# EAGLE design LifterV01 (EAGLE 9.5.1)

## Sheet 1 of 2: Analog Circuit
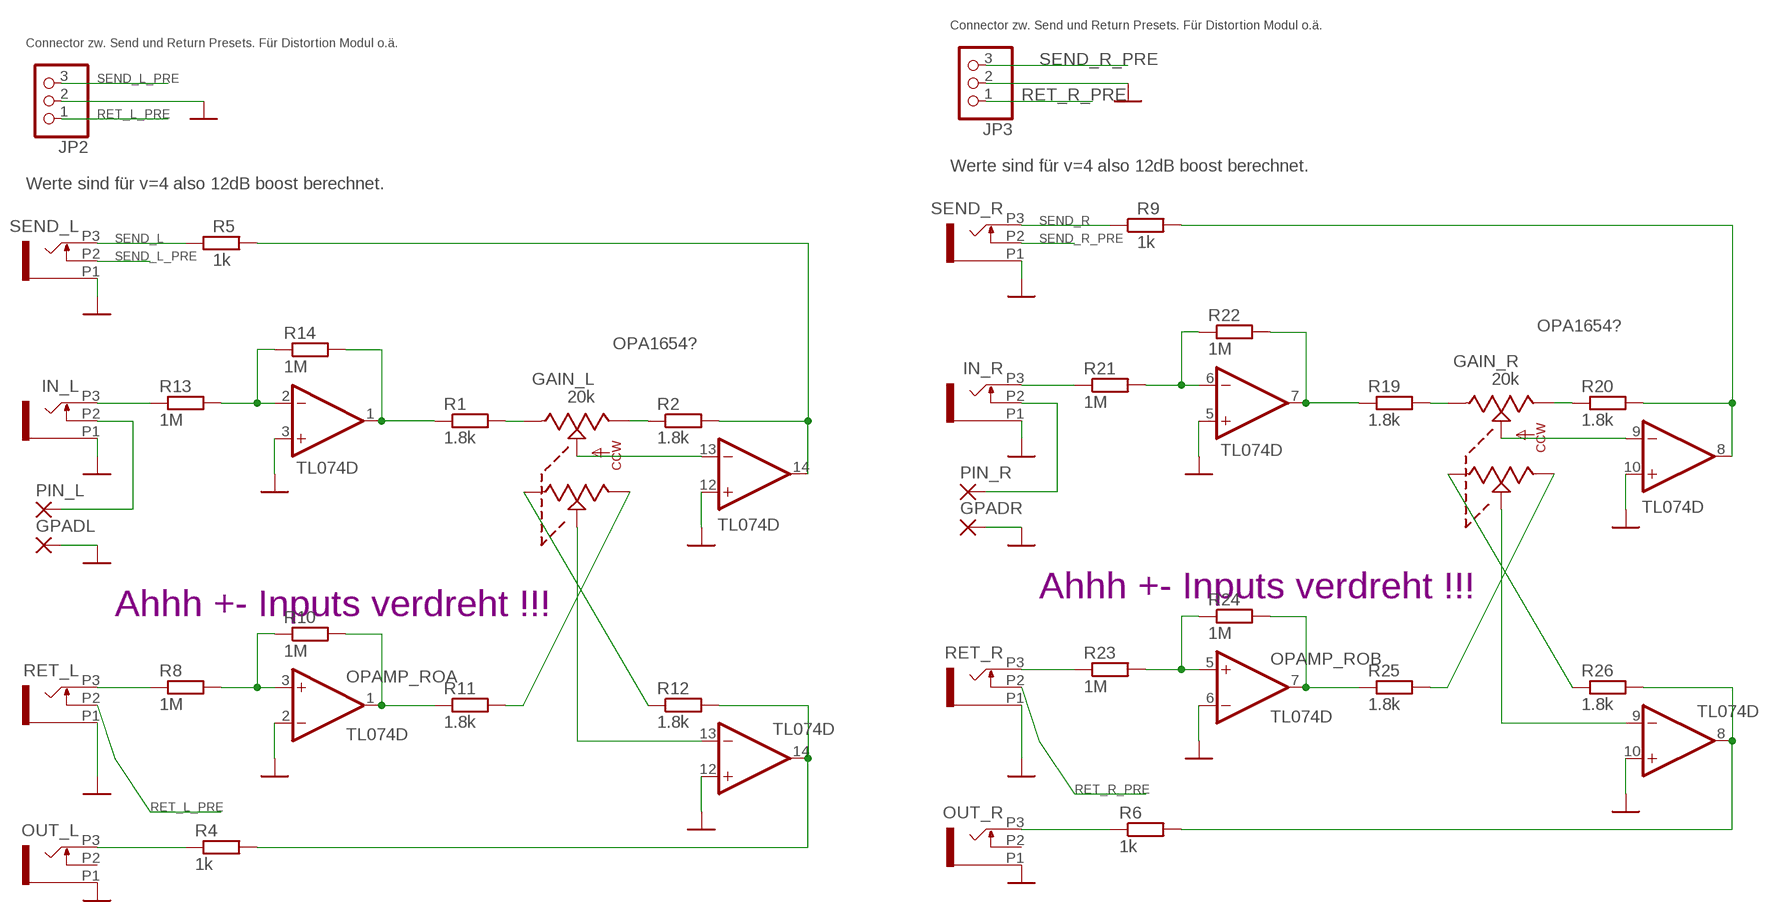
[diagram p0: schematic, sheet 1]

### Parts
GAIN_L  20k  POT_US_2X  [TT_2TAP_VERTICAL]
GAIN_R  20k  POT_US_2X  [TT_2TAP_VERTICAL]
GPADL  3,17/1,3  [3,17/1,3]
GPADR  3,17/1,3  [3,17/1,3]
IN_L  PJ301_THONKICONN6  [WQP_PJ_301M6]
IN_R  PJ301_THONKICONN6  [WQP_PJ_301M6]
JP2  PINHD-1X3  [1X03]
JP3  PINHD-1X3  [1X03]
OPAMP_IS  TL074D  [SO14]
OPAMP_RO  TL074D  [SO14]
OUT_L  PJ301_THONKICONN6  [WQP_PJ_301M6]
OUT_R  PJ301_THONKICONN6  [WQP_PJ_301M6]
PIN_L  3,17/1,3  [3,17/1,3]
PIN_R  3,17/1,3  [3,17/1,3]
R1  1.8k  R-EU_R0603  [R0603]
R2  1.8k  R-EU_R0603  [R0603]
R4  1k  R-EU_R0603  [R0603]
R5  1k  R-EU_R0603  [R0603]
R6  1k  R-EU_R0603  [R0603]
R8  1M  R-EU_R0603  [R0603]
R9  1k  R-EU_R0603  [R0603]
R10  1M  R-EU_R0603  [R0603]
R11  1.8k  R-EU_R0603  [R0603]
R12  1.8k  R-EU_R0603  [R0603]
R13  1M  R-EU_R0603  [R0603]
R14  1M  R-EU_R0603  [R0603]
R19  1.8k  R-EU_R0603  [R0603]
R20  1.8k  R-EU_R0603  [R0603]
R21  1M  R-EU_R0603  [R0603]
R22  1M  R-EU_R0603  [R0603]
R23  1M  R-EU_R0603  [R0603]
R24  1M  R-EU_R0603  [R0603]
R25  1.8k  R-EU_R0603  [R0603]
R26  1.8k  R-EU_R0603  [R0603]
RET_L  PJ301_THONKICONN6  [WQP_PJ_301M6]
RET_R  PJ301_THONKICONN6  [WQP_PJ_301M6]
SEND_L  PJ301_THONKICONN6  [WQP_PJ_301M6]
SEND_R  PJ301_THONKICONN6  [WQP_PJ_301M6]

### Nets
GND: GPADL.1(P) GPADR.1(P) IN_L.P1 IN_R.P1 JP2.2 JP3.2 OPAMP_IS.3(A:+IN) OPAMP_IS.5(B:+IN) OPAMP_IS.10(C:+IN) OPAMP_IS.12(D:+IN) OPAMP_RO.2(A:-IN) OPAMP_RO.6(B:-IN) OPAMP_RO.10(C:+IN) OPAMP_RO.12(D:+IN) OUT_L.P1 OUT_R.P1 RET_L.P1 RET_R.P1 SEND_L.P1 SEND_R.P1 ; also sheet 2
N$1: GAIN_L.CCW R2.1
N$2: GAIN_L.CW R1.2
N$3: OPAMP_IS.14(D:OUT) R2.2 R5.2
N$4: GAIN_L.CENTER OPAMP_IS.13(D:-IN)
N$5: IN_L.P3 R13.1
N$6: OPAMP_IS.2(A:-IN) R13.2 R14.1
N$8: OPAMP_IS.1(A:OUT) R1.1 R14.2
N$9: OUT_L.P3 R4.1
N$10: R8.1 RET_L.P3
N$11: IN_L.P2 PIN_L.1(P)
N$17: OPAMP_RO.3(A:+IN) R8.2 R10.1
N$18: GAIN_L.CW1 R12.1
N$20: OPAMP_IS.8(C:OUT) R9.2 R20.2
N$21: OPAMP_RO.1(A:OUT) R10.2 R11.1
N$22: GAIN_L.CCW1 R11.2
N$23: GAIN_L.CENTER1 OPAMP_RO.13(D:-IN)
N$24: OPAMP_RO.14(D:OUT) R4.2 R12.2
N$26: IN_R.P2 PIN_R.1(P)
N$27: GAIN_R.CW R19.2
N$28: GAIN_R.CENTER OPAMP_IS.9(C:-IN)
N$29: GAIN_R.CCW R20.1
N$30: IN_R.P3 R21.1
N$31: OPAMP_IS.6(B:-IN) R21.2 R22.1
N$32: OPAMP_IS.7(B:OUT) R19.1 R22.2
N$33: R23.1 RET_R.P3
N$34: OPAMP_RO.5(B:+IN) R23.2 R24.1
N$35: OPAMP_RO.7(B:OUT) R24.2 R25.1
N$36: GAIN_R.CCW1 R25.2
N$37: GAIN_R.CW1 R26.1
N$38: GAIN_R.CENTER1 OPAMP_RO.9(C:-IN)
N$39: OPAMP_RO.8(C:OUT) R6.2 R26.2
N$40: OUT_R.P3 R6.1
RET_L_PRE: JP2.1 RET_L.P2
RET_R_PRE: JP3.1 RET_R.P2
SEND_L: R5.1 SEND_L.P3 ; also sheet 2
SEND_L_PRE: JP2.3 SEND_L.P2
SEND_R: R9.1 SEND_R.P3 ; also sheet 2
SEND_R_PRE: JP3.3 SEND_R.P2
Unconnected: OUT_L.P2 OUT_R.P2

### Notes on the sheet
- Connector zw. Send und Return Presets. Für Distortion Modul o.ä.
- Connector zw. Send und Return Presets. Für Distortion Modul o.ä.
- Werte sind für v=4 also 12dB boost berechnet.
- Werte sind für v=4 also 12dB boost berechnet.
- OPA1654?
- OPA1654?
- Ahhh +- Inputs verdreht !!!
- Ahhh +- Inputs verdreht !!!

## Sheet 2 of 2: Power Supply
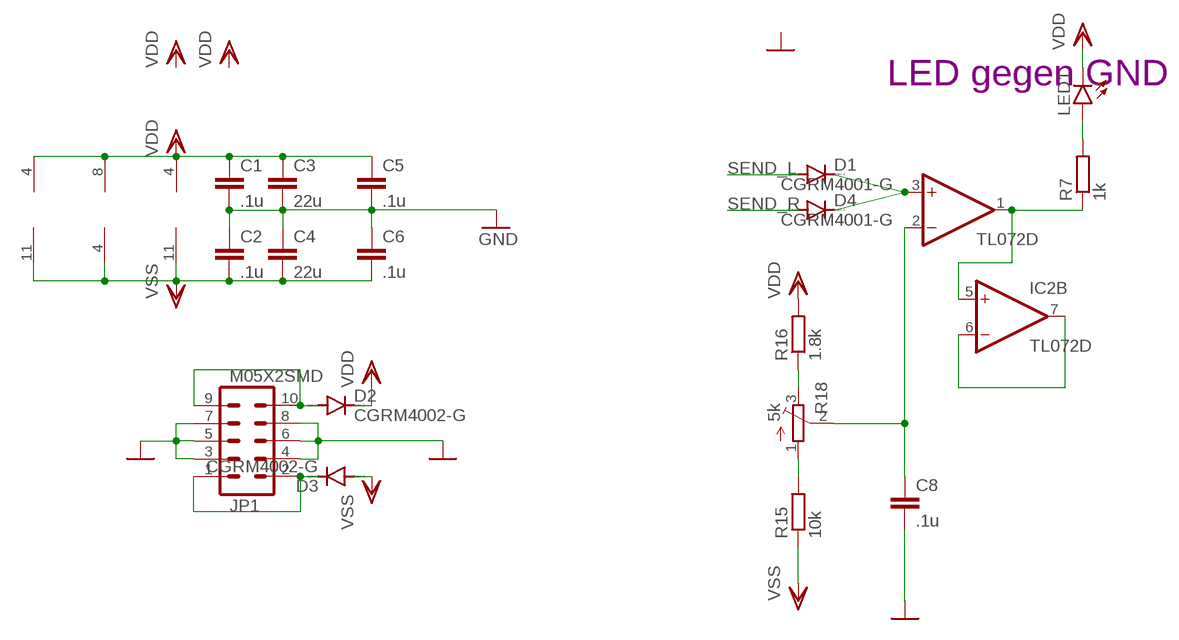
[diagram p1: schematic, sheet 2]

### Parts
C1  .1u  C-EUC0603  [C0603]
C2  .1u  C-EUC0603  [C0603]
C3  22u  C-EUC1210  [C1210]
C4  22u  C-EUC1210  [C1210]
C5  .1u  C-EUC0603  [C0603]
C6  .1u  C-EUC0603  [C0603]
C8  .1u  C-EUC0603  [C0603]
D1  CGRM4001-G  [SOD-123_MINI-SMA]
D2  CGRM4002-G  [SOD-123_MINI-SMA]
D3  CGRM4002-G  [SOD-123_MINI-SMA]
D4  CGRM4001-G  [SOD-123_MINI-SMA]
IC2  TL072D  [SO08]
JP1  M05X2SMD  [2X5-SMD]
LED1  LED3MM  [LED3MM]
R7  1k  R-EU_R0603  [R0603]
R15  10k  R-EU_R0603  [R0603]
R16  1.8k  R-EU_R0603  [R0603]
R18  5k  TRIM_EU-3223G  [3223G]

### Nets
GND: C1.2 C2.1 C3.2 C4.1 C5.2 C6.1 C8.2 JP1.3 JP1.4 JP1.5 JP1.6 JP1.7 JP1.8 ; also sheet 1
N$7: IC2.6(B:-IN) IC2.7(B:OUT)
N$12: D2.A JP1.9 JP1.10
N$13: D1.C D4.C IC2.3(A:+IN)
N$14: D3.C JP1.1 JP1.2
N$15: LED1.A R7.2
N$16: IC2.1(A:OUT) IC2.5(B:+IN) R7.1
N$19: C8.1 IC2.2(A:-IN) R18.2(S)
N$25: R16.1 R18.3(E)
N$44: R15.2 R18.1(A)
SEND_L: D1.A ; also sheet 1
SEND_R: D4.A ; also sheet 1
VDD: C1.1 C3.1 C5.1 D2.C IC2.8(P:V+) LED1.K(C) OPAMP_IS.4(P:V+) OPAMP_RO.4(P:V+) R16.2
VSS: C2.2 C4.2 C6.2 D3.A IC2.4(P:V-) OPAMP_IS.11(P:V-) OPAMP_RO.11(P:V-) R15.1

### Notes on the sheet
- LED gegen GND

## Library data of the parts
C1-C6 C8 = rcl:C-EU: CAPACITOR, European symbol; SPICEPREFIX: C
D1-D4 = diode:CGRM400*-G: Molded plasitc,JEDEC SOD-123/Mini SMA Source: Comchip CGRM4001-G.pdf
GAIN_L GAIN_R = og-pots:POT_US_2X
GPADL GPADR PIN_L PIN_R = wirepad:3,17/1,3: THROUGH-HOLE PAD
IC2 = linear:TL072: OP AMP
IN_L IN_R OUT_L OUT_R RET_L RET_R SEND_L SEND_R = og-pj301:PJ301_THONKICONN
JP1 = og-header:M05X2: Header 5x2 Standard 10-pin dual row 0.1" header. Commonly used with AVR-ISP. Use with Spark Fun Electronics SKU: PRT-00778
JP2 JP3 = pinhead:PINHD-1X3: PIN HEADER
LED1 = led:LED: LED OSRAM: - CHIPLED LG R971, LG N971, LY N971, LG Q971, LY Q971, LO R971, LY R971 LH N974, LH R974 LS Q976, LO Q976, LY Q976 LO Q996 - Hyper CHIPLED LW Q18S LB Q993, LB Q99A, LB R99A - SideLED LS A670, LO A670, LY A670, LG A670, LP A670 LB A673, LV A673, LT A673, LW A673 LH A674 LY A675 LS A676, LA A676, LO A676, LY A676, LW A676 LS A679, LY A679, LG A679 - Hyper Micro SIDELED® LS Y876, LA Y876, LO Y876, LY Y876 LT Y87S - SmartLED LW L88C, LW L88S LB L89C, LB L89S, LG L890 LS L89K, LO L89K, LY L89K LS L896, LA L896, LO L896, LY L896 - TOPLED LS T670, LO T670, LY T670, LG T670, LP T670 LSG T670, LSP T670, LSY T670, LOP T670, LYG T670 LG T671, LOG T671, LSG T671 LB T673, LV T673, LT T673, LW T673 LH T674 LS T676, LA T676, LO T676, LY T676, LB T676, LH T676, LSB T676, LW T676 LB T67C, LV T67C, LT T67C, LS T67K, LO T67K, LY T67K, LW E67C LS E67B, LA E67B, LO E67B, LY E67B, LB E67C, LV E67C, LT E67C LW T67C LS T679, LY T679, LG T679 LS T770, LO T770, LY T770, LG T770, LP T770 LB T773, LV T773, LT T773, LW T773 LH T774 LS E675, LA E675, LY E675, LS T675 LS T776, LA T776, LO T776, LY T776, LB T776 LHGB T686 LT T68C, LB T68C - Hyper Mini TOPLED® LB M676 - Mini TOPLED Santana® LG M470 LS M47K, LO M47K, LY M47K Source: http://www.osram.convergy.de LUXEON: - LUMILED® LXK2-PW12-R00, LXK2-PW12-S00, LXK2-PW14-U00, LXK2-PW14-V00 LXK2-PM12-R00, LXK2-PM12-S00, LXK2-PM14-U00 LXK2-PE12-Q00, LXK2-PE12-R00, LXK2-PE12-S00, LXK2-PE14-T00, LXK2-PE14-U00 LXK2-PB12-K00, LXK2-PB12-L00, LXK2-PB12-M00, LXK2-PB14-N00, LXK2-PB14-P00, LXK2-PB14-Q00 LXK2-PR12-L00, LXK2-PR12-M00, LXK2-PR14-Q00, LXK2-PR14-R00 LXK2-PD12-Q00, LXK2-PD12-R00, LXK2-PD12-S00 LXK2-PH12-R00, LXK2-PH12-S00 LXK2-PL12-P00, LXK2-PL12-Q00, LXK2-PL12-R00 Source: www.luxeon.com KINGBRIGHT: KA-3528ASYC Source: www.kingbright.com
OPAMP_IS OPAMP_RO = linear:TL074: OP AMP; SPICEPREFIX: J
R1 R2 R4-R16 R19-R26 = rcl:R-EU_: RESISTOR, European symbol; SPICEPREFIX: R
R18 = pot:TRIM_EU-: POTENTIOMETER; MOUSER: 652-TC33X-2-502G

## Board
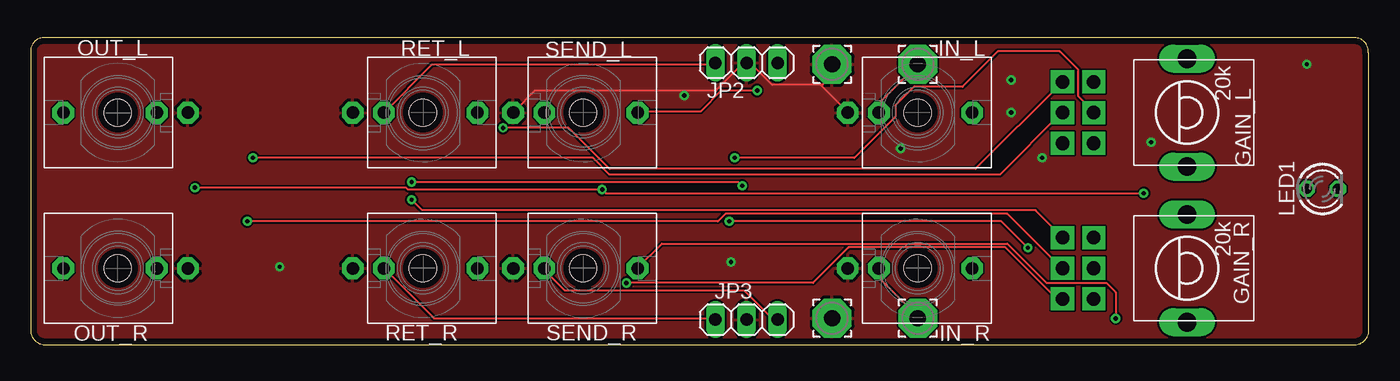
[diagram p2: board, top side]
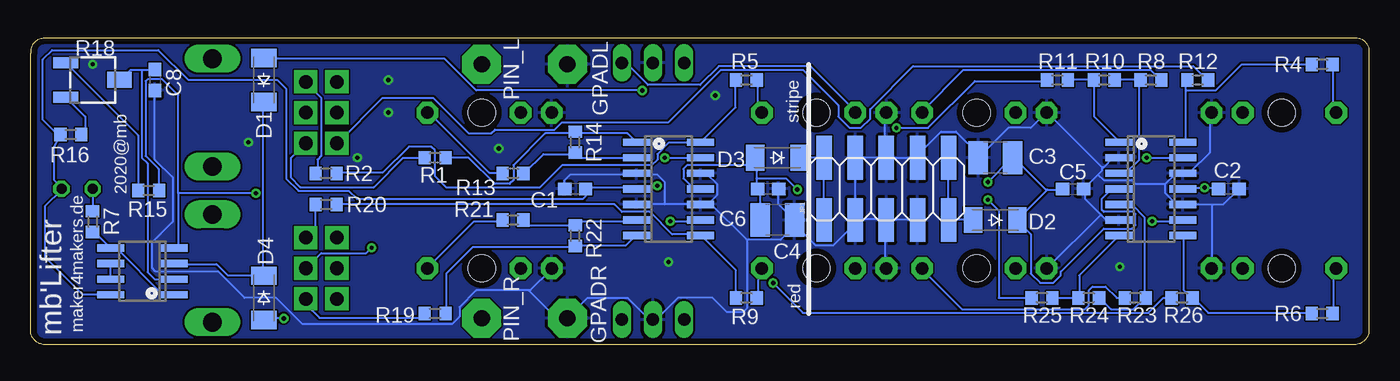
[diagram p3: board, bottom side, seen from below]

Size 109.21 x 25.03 mm. Coordinates in mm from the lower left corner, seen from the top.
Outline: 0,1.27 arc100 1.27,0 107.95,0 arc100 109.2,1.25 109.2,23.68 arc10 109.17,23.8 arc100 107.95,25.02 1.15,25.02 arc100 0,23.88 0,1.27
Copper layers (1*16): Top 0.035mm / dielectric 1.5mm / Bottom 0.035mm
Design rules "default *": minimum track width 6mil, minimum drill 0.35mm, track to track 6mil, track to pad 6mil, pad to pad 6mil, via to via 6mil, smd to smd 6mil, copper to edge 20mil, drill to drill 6mil, minimum pad ring 10mil, minimum via ring 8mil, stop-mask expansion 4mil, vias tented up to drill 0mil, thermal gap 10mil

### Footprints (pad centres in the part's own frame; a part is rotated, then mirrored left to right if it is on the bottom)
C0603 = smd 1.1 x 1: 1 -0.85,0; 2 0.85,0
C1210 = smd 1.6 x 2.7: 1 -1.4,0; 2 1.4,0
SOD-123_MINI-SMA = smd 1.5 x 2.1: A 1.8,0; C -1.8,0
TT_2TAP_VERTICAL = drill 1.118 pad 1.88 square: CCW 2.5,7.608; CCW1 2.5,10.148; CENTER 0,7.608; CENTER1 0,10.148; CW -2.5,7.608; CW1 -2.5,10.148 | drill 1.524 pad 2.184 long: P$4 -4.4,0; P$5 4.4,0
3,17/1,3 = drill 1.321 pad 3.175 octagon: 1 0,0
SO08 = smd 0.6 x 2.2: 1 -1.905,-2.6; 2 -0.635,-2.6; 3 0.635,-2.6; 4 1.905,-2.6; 5 1.905,2.6; 6 0.635,2.6; 7 -0.635,2.6; 8 -1.905,2.6
WQP_PJ_301M6 = drill 1.016 pad 1.778 octagon: P1 0,-5.715; P2 0,-3.175; P3 0,4.445 | hole 2.2: 0,0
2X5-SMD = smd 3.556 x 1.27: 1 -2.54,5.08; 2 2.54,5.08; 3 -2.54,2.54; 4 2.54,2.54; 5 -2.54,0; 6 2.54,0; 7 -2.54,-2.54; 8 2.54,-2.54; 9 -2.54,-5.08; 10 2.54,-5.08
1X03 = drill 1.016 long: 1 -2.54,0; 2 0,0; 3 2.54,0
LED3MM = drill 0.813 octagon: A -1.27,0; K 1.27,0
SO14 = smd 0.6 x 2.2: 1 -3.81,-2.6; 2 -2.54,-2.6; 3 -1.27,-2.6; 4 0,-2.6; 5 1.27,-2.6; 6 2.54,-2.6; 7 3.81,-2.6; 8 3.81,2.6; 9 2.54,2.6; 10 1.27,2.6; 11 0,2.6; 12 -1.27,2.6; 13 -2.54,2.6; 14 -3.81,2.6
R0603 = smd 1 x 1.1: 1 -0.85,0; 2 0.85,0
3223G = smd 2 x 0.9: 1 -2.2,1.4; 3 -2.2,-1.4 | smd 2 x 1.3: 2 2.2,0

### Placement (x,y rotation side)
C1  64.77,12.7 180 bottom
C2  11.43,12.7 180 bottom
C3  30.48,15.24 180 bottom
C4  48.26,10.16 180 bottom
C5  24.13,12.7 0 bottom
C6  49.03,12.7 180 bottom
C8  99.06,21.59 270 bottom
D1  90.17,21.59 90 bottom
D2  30.48,10.16 180 bottom
D3  48.26,15.24 180 bottom
D4  90.17,3.81 270 bottom
GAIN_L  94.37,18.93 90 top
GAIN_R  94.37,6.23 90 top
GPADL  65.41,22.86 0 top
GPADR  65.41,2.16 0 top
IC2  100.08,5.97 90 bottom
IN_L  72.39,18.93 270 top
IN_R  72.39,6.23 270 top
JP1  39.37,12.7 90 bottom
JP2  58.42,22.99 0 top
JP3  58.42,2.04 0 top
LED1  105.41,12.7 0 top
OPAMP_IS  57.15,12.7 270 bottom
OPAMP_RO  17.78,12.7 270 bottom
OUT_L  7.12,18.93 90 top
OUT_R  7.12,6.23 90 top
PIN_L  72.39,22.86 180 top
PIN_R  72.39,2.16 0 top
R1  76.2,15.24 180 bottom
R2  85.09,13.97 0 bottom
R4  3.81,22.86 180 bottom
R5  50.8,21.59 180 bottom
R6  3.81,2.54 180 bottom
R7  104.14,10.04 90 bottom
R8  17.78,21.59 180 bottom
R9  50.8,3.81 180 bottom
R10  21.59,21.59 180 bottom
R11  25.4,21.59 180 bottom
R12  13.97,21.59 180 bottom
R13  69.85,13.97 0 bottom
R14  64.77,16.51 90 bottom
R15  99.57,12.58 180 bottom
R16  105.92,17.15 180 bottom
R18  104.14,21.59 0 bottom
R19  76.2,2.54 180 bottom
R20  85.09,11.43 0 bottom
R21  69.85,10.16 0 bottom
R22  64.77,8.89 270 bottom
R23  19.05,3.81 0 bottom
R24  22.86,3.81 180 bottom
R25  26.67,3.81 180 bottom
R26  15.24,3.81 0 bottom
RET_L  32.01,18.93 270 top
RET_R  32.01,6.23 270 top
SEND_L  45.09,18.93 270 top
SEND_R  45.09,6.23 270 top

### Tracks (layer width: path | path; a pad name or v marks a point on that pad's centre or on a via)
GND  (via drill 0.35)
  Top 0.152: 64.47,21.19 64.62,21.19 65.41,21.98 GPADL.1 | 64.47,21.19 60.51,21.19 58.83,22.86 58.53,22.86 JP2.2 58.37,22.86 58.07,22.86 55.94,20.73 41.15,20.73 39.48,19.05 SEND_L.P1 | 64.47,21.19 66.6,19.05 IN_L.P1
  Bottom 0.152: C8.2 99.06,15.09 97.59,13.62 97.59,10.06 99.29,8.36 99.29,6.25 98.99,5.95 93.88,5.95 91.75,3.81 89.16,3.81 87.02,1.68 74.83,1.68 74.22,2.29 74.22,3.05 72.85,4.42 68.58,4.42 | 68.58,4.42 68.43,4.42 66.76,6.1 IN_R.P1 | 68.58,4.42 66.55,2.39 GPADR.1 63.76,3.81 60.51,3.81 58.83,2.14 58.53,2.14 JP3.2 58.37,2.14 58.07,2.14 56.39,3.81 53.55,3.81 52.38,2.65 51.06,2.65 50.75,2.95 50.75,8.54 | 12.81,11.43 OPAMP_RO.10 15.7,11.43 16.62,12.35 16.62,13.11 | 12.81,11.43 11.89,11.43 10.67,12.65 C2.1 | 16.62,13.11 15.85,13.87 15.24,13.87 OPAMP_RO.12 15.09,14.03 14.63,14.03 12.96,15.7 12.96,18.9 OUT_L.P1 | 12.81,11.43 12.81,6.25 OUT_R.P1 | 31.7,15.4 29.42,17.68 27.59,17.68 26.37,18.9 RET_L.P1 26.22,18.9 21.8,14.48 21.65,14.48 | 31.7,15.4 31.86,15.24 C3.2 31.7,15.4 | 22.1,13.87 21.8,14.18 21.8,14.33 21.65,14.48 | 22.1,13.87 23.17,12.81 C5.2 23.17,12.65 23.17,11.89 21.8,10.52 | 21.65,14.48 20.88,15.24 OPAMP_RO.2 | 21.8,10.52 21.49,10.22 20.43,10.22 OPAMP_RO.6 | 21.8,10.52 21.95,10.52 26.22,6.25 RET_R.P1 | 16.62,13.11 19.05,13.11 19.36,13.42 21.65,13.42 22.1,13.87 | 37.04,15.24 JP1.6 39.48,15.24 | 37.04,15.24 JP1.8 | 39.48,15.24 JP1.4 41.91,10.22 | 39.48,15.24 39.48,18.9 SEND_L.P1 | C1.2 65.62,13.43 65.18,13.87 59.9,13.87 OPAMP_IS.3 59.75,13.87 58.07,13.87 57.46,13.26 57.46,11.43 | OPAMP_IS.10 53.95,11.43 53.8,11.59 | 53.8,11.59 53.19,12.2 53.19,13.11 53.95,13.87 54.41,13.87 OPAMP_IS.12 | OPAMP_IS.10 57.46,11.43 | 57.46,11.43 OPAMP_IS.5 | C6.1 48.16,12.65 48.16,11.43 46.94,10.22 C4.1 | 46.79,9.76 46.79,10.06 C4.1 | 46.79,9.76 45.11,8.08 43.74,8.08 41.91,9.91 JP1.3 41.91,10.22
  Bottom 0.152: JP1.7 36.89,10.22 39.32,10.22 JP1.5 | SEND_R.P1 39.48,6.25 39.48,10.06 JP1.5 | 41.91,10.22 39.48,10.22 JP1.5 | 50.75,8.54 53.8,11.59 | 50.75,8.54 48.01,8.54 46.79,9.76 | 53.8,11.59 OPAMP_IS.10 | 46.79,9.76 C4.1 | 31.7,15.4 33.68,17.38 34.9,17.38 37.04,15.24
  other vias: 80.01,21.59 82.55,15.24 80.01,18.93 53.34,20.32 20.32,6.35 91.44,16.51 104.14,22.86 71,16.01 57.15,6.74
  pour Bottom: 110.49,26.67 110.49,-1.27 -1.27,-1.27 -1.27,26.67
  pour Top: 111.76,27.94 111.76,-1.27 -1.27,-1.27 -1.27,26.67 110.49,26.67
N$1
  Bottom 0.152: R2.1 85.81,14.03 85.81,15.09 85.5,15.4 85.5,20.12 86.72,21.34 GAIN_L.CCW
N$2
  Bottom 0.152: R1.2 78.8,15.24 81.18,12.86 87.2,12.86 87.99,13.64 87.99,15.19 GAIN_L.CW
N$3
  Bottom 0.152: R5.2 51.67,21.49 51.67,19.36 54.41,16.62 OPAMP_IS.14 54.56,16.46 57.15,16.46 58.07,15.55 58.07,15.09 58.53,14.63 65.84,14.63 67.67,12.81 75.26,12.81 76.2,13.75 76.2,15.85 76.51,16.16 78.34,16.16 80.47,14.03 84.13,14.03 R2.2
N$4  (via drill 0.35)
  Top 0.152: v57.46,15.24 67.21,15.24 70.57,18.6 70.57,19.51 72.09,21.04 76.05,21.04 78.95,23.93 83.98,23.93 85.5,22.41 85.5,20.27 86.72,19.05 GAIN_L.CENTER
  Bottom 0.152: v57.46,15.24 OPAMP_IS.13
N$5
  Bottom 0.152: R13.1 70.72,14.03 71.78,14.03 76.81,19.05 IN_L.P3
N$6
  Bottom 0.152: 64.77,15.55 67.37,15.55 68.89,14.03 R13.2 | OPAMP_IS.2 64.47,15.24 64.77,15.55 | 64.77,15.55 R14.1
N$7
  Bottom 0.152: IC2.7 102.72,5.34 102.72,6.56 IC2.6
N$8
  Bottom 0.152: 64.77,17.23 60.51,17.23 59.9,16.62 OPAMP_IS.1 | R1.1 73.46,15.24 71.33,13.11 70.11,13.11 69.8,13.42 69.8,14.63 67.21,17.23 64.77,17.23 | 64.77,17.23 R14.2
N$9
  Bottom 0.152: R4.1 2.9,22.86 2.9,19.21 2.75,19.05 OUT_L.P3
N$10
  Bottom 0.152: R8.1 17.07,21.65 17.84,22.41 33.08,22.41 36.43,19.05 RET_L.P3
N$11
  Top 0.152: PIN_L.1 69.35,19.82 69.35,19.05 IN_L.P2
N$12
  Bottom 0.152: 34.29,10.22 32.31,10.22 D2.A | 34.29,10.22 JP1.10 | 34.29,10.22 JP1.9
N$13
  Bottom 0.152: 90.23,5.64 93.12,5.64 94.04,6.56 97.39,6.56 IC2.3 | 90.23,5.64 90.23,19.66 D1.C | 90.23,5.64 D4.C
N$14
  Bottom 0.152: 44.51,15.24 D3.C | 44.51,15.24 44.51,10.22 JP1.1 | 44.51,15.24 JP1.2
N$15
  Bottom 0.152: LED1.A R7.2
N$16
  Bottom 0.152: R7.1 103.93,9.13 IC2.5 102.57,7.78 102.11,7.78 98.45,4.12 97.54,4.12 IC2.1
N$17
  Bottom 0.152: R10.1 20.73,21.65 18.75,21.65 R8.2 18.75,21.49 18.75,15.09 19.82,14.03 20.27,14.03 OPAMP_RO.3
N$18
  Bottom 0.152: R12.1 13.26,21.65 14.33,22.71 37.19,22.71 40.7,19.21 40.7,18.44 41.46,17.68 42.37,17.68 43.29,18.6 43.29,19.51 46.18,22.41 52.89,22.41 57.15,18.14 65.84,18.14 66.45,17.53 71.33,17.53 71.63,17.23 73.46,17.23 76.36,20.12 80.47,20.12 84.13,16.46 GAIN_L.CW1
N$19
  Bottom 0.152: 100.13,22.41 101.05,22.41 101.81,21.65 R18.2 | 100.13,22.41 99.06,22.41 C8.1 | IC2.2 99.09,5.34 99.67,5.92 99.67,14.79 100.13,15.24 100.13,22.41
N$20
  Bottom 0.152: R9.2 51.67,3.81 51.67,6.1 54.41,8.84 OPAMP_IS.8 54.56,9 56.85,9 58.68,10.82 60.96,10.82 61.57,11.43 R20.2
N$21
  Bottom 0.152: R11.1 24.54,21.65 22.56,21.65 R10.2 22.41,21.49 22.41,18.6 20.43,16.62 OPAMP_RO.1
N$22  (via drill 0.35)
  Top 0.152: v38.56,17.68 43.9,17.68 47.25,14.33 77.12,14.33 84.13,21.34 GAIN_L.CCW1
  Bottom 0.152: v38.56,17.68 35.97,17.68 32.16,21.49 26.37,21.49 R11.2
N$23  (via drill 0.35)
  Top 0.152: v18.14,15.24 45.88,15.24 47.25,13.87 79.1,13.87 84.13,18.9 GAIN_L.CENTER1
  Bottom 0.152: v18.14,15.24 OPAMP_RO.13
N$24
  Bottom 0.152: 14.94,20.73 14.94,16.77 15.09,16.62 OPAMP_RO.14 | 14.94,20.73 14.94,21.49 R12.2 | R4.2 10.37,22.86 12.5,20.73 14.94,20.73
N$25
  Bottom 0.152: R16.1 104.75,17.47 104.75,18.6 R18.3
N$26
  Top 0.152: IN_R.P2 69.35,6.1 69.35,5.34 72.39,2.29 PIN_R.1
N$27
  Bottom 0.152: R19.2 77.28,2.19 85.63,2.19 86.21,2.77 GAIN_R.CW
N$28  (via drill 0.35)
  Top 0.152: v81.39,7.9 79.23,10.06 v57,10.06
  Bottom 0.152: v57,10.06 54.56,10.06 OPAMP_IS.9 | GAIN_R.CENTER 86.72,6.25 85.5,7.47 81.82,7.47 v81.39,7.9
N$29
  Bottom 0.152: R20.1 85.96,11.43 85.96,9.61 86.72,8.84 GAIN_R.CCW
N$30
  Bottom 0.152: IN_R.P3 73,10.06 70.72,10.06 R21.1
N$31
  Bottom 0.152: 64.77,9.76 68.58,9.76 68.89,10.06 R21.2 | 64.77,9.76 64.47,10.06 59.9,10.06 OPAMP_IS.6 | 64.77,9.76 R22.1
N$32
  Bottom 0.152: OPAMP_IS.7 59.9,8.84 60.66,8.08 64.77,8.08 R22.2 64.77,7.93 73.16,7.93 75.29,5.8 75.29,2.6 R19.1
N$33
  Bottom 0.152: R23.1 20.58,3.81 21.49,4.73 22.56,4.73 22.86,4.42 22.86,3.2 23.17,2.9 33.23,2.9 36.43,6.1 RET_R.P3
N$34
  Bottom 0.152: 18.29,3.81 19.21,2.9 21.04,2.9 21.95,3.81 R24.1 | OPAMP_RO.5 19.36,11.43 18.29,10.37 18.29,3.81 | 18.29,3.81 R23.2
N$35
  Bottom 0.152: R25.1 R24.2 23.63,3.81 23.63,5.64 20.43,8.84 OPAMP_RO.7
N$36  (via drill 0.35)
  Top 0.152: v31.09,11.82 31.93,10.98 82,10.98 84.13,8.84 GAIN_R.CCW1
  Bottom 0.152: R25.2 30.21,3.81 30.21,10.93 v31.09,11.82
N$37  (via drill 0.35)
  Top 0.152: v48.62,5.03 63.86,5.03 66.76,7.93 79.56,7.93 83.67,3.81 84.13,3.81 GAIN_R.CW1
  Bottom 0.152: R26.1 16.77,3.81 17.99,2.6 46.18,2.6 v48.62,5.03
N$38  (via drill 0.35)
  Top 0.152: v17.68,10.06 56.09,10.06 56.7,10.67 79.71,10.67 82.66,7.73 84.13,6.25 GAIN_R.CENTER1
  Bottom 0.152: v17.68,10.06 15.24,10.06 OPAMP_RO.9
N$39
  Bottom 0.152: R6.2 4.73,2.6 13.11,2.6 14.33,3.81 R26.2 14.48,3.81 15.09,4.42 15.09,8.84 OPAMP_RO.8
N$40
  Bottom 0.152: R6.1 2.9,2.6 2.9,5.95 2.75,6.1 OUT_R.P3
N$44
  Bottom 0.152: R15.2 100.44,12.65 100.44,17.07 106.23,22.86 R18.1
RET_L_PRE
  Top 0.152: RET_L.P2 32.77,22.86 55.78,22.86 JP2.1
RET_R_PRE
  Top 0.152: RET_R.P2 32.92,2.14 55.78,2.14 JP3.1
SEND_L  (via drill 0.35)
  Top 0.152: v59.29,20.73 56.39,20.73 54.72,19.05 49.53,19.05 SEND_L.P3
  Bottom 0.152: R5.1 49.84,21.49 49.84,19.36 49.53,19.05 SEND_L.P3 | v59.29,20.73 72.85,20.73 75.44,23.32 90.07,23.32 D1.A
SEND_L_PRE
  Bottom 0.152: JP2.3 60.96,22.86 60.51,22.86 58.83,21.19 54.56,21.19 53.04,22.71 45.57,22.71 41.91,19.05 SEND_L.P2
SEND_R  (via drill 0.35)
  Top 0.152: v88.55,2.14 88.55,4.27 87.79,5.03 82.91,5.03 79.71,8.23 51.52,8.23 49.53,6.25 SEND_R.P3
  Bottom 0.152: R9.1 49.84,3.81 49.84,5.8 49.53,6.1 SEND_R.P3 | v88.55,2.14 90.07,2.14 D4.A
SEND_R_PRE
  Top 0.152: JP3.3 60.96,2.14 60.51,2.14 58.22,4.42 43.59,4.42 41.91,6.1 SEND_R.P2
VDD  (via drill 0.35)
  Top 0.152: v31.09,13.26 57.76,13.26 v58.07,12.96
  Bottom 0.152: 26.22,12.65 25,12.65 C5.1 | 26.22,12.65 28.66,10.22 D2.C 28.66,10.06 27.59,9 27.59,5.8 26.83,5.03 25.76,5.03 25.15,5.64 25.15,5.95 21.65,9.45 19.36,9.45 19.05,9.76 19.05,10.67 19.21,10.82 21.65,10.82 21.8,10.98 21.8,11.89 21.04,12.65 20.43,12.65 OPAMP_RO.4 | 26.22,12.65 26.37,12.65 28.96,15.24 C3.1 29.11,15.24 v31.09,13.26 | IC2.8 102.72,4.12 105.01,4.12 108.06,7.17 108.06,11.28 106.68,12.65 LED1.K 106.68,12.81 107.29,13.42 107.29,16.16 R16.2 106.88,17.02 108.21,18.34 108.21,23.27 107.45,24.03 98.79,24.03 96.35,21.59 89.08,21.59 88.35,20.86 88.35,13.54 87.36,12.55 83.24,12.55 82.58,11.89 64.14,11.89 63.92,12.11 C1.1 63.86,12.81 59.9,12.81 OPAMP_IS.4 59.75,12.81 59.59,12.96 v58.07,12.96
VSS  (via drill 0.35)
  Top 0.152: v13.42,12.81 30.64,12.81 30.79,12.65 v46.64,12.65 46.94,12.35 v90.83,12.35
  Bottom 0.152: IC2.4 97.16,8.2 97.16,12.35 | 97.16,12.35 97.16,20.35 98.45,21.65 99.67,21.65 99.83,21.49 99.83,15.4 98.76,14.33 98.76,12.65 R15.1 | C2.2 12.35,12.81 v13.42,12.81 15.09,12.81 OPAMP_RO.11 | 49.99,14.63 49.99,15.24 D3.A 49.99,14.63 | 49.99,14.63 49.99,13.57 | 49.99,13.57 49.99,12.81 C6.2 49.84,12.65 49.69,12.5 49.69,10.22 C4.2 | 49.99,14.63 55.63,14.63 55.94,14.33 55.94,13.57 55.17,12.81 54.56,12.81 OPAMP_IS.11 | v46.64,12.65 47.55,13.57 49.99,13.57 | v90.83,12.35 97.16,12.35

### Text on the board
bNames: stripe | 2020@mb | maker4makers.de | red | mb'Lifter